# EAGLE design alfie (EAGLE 6.2)
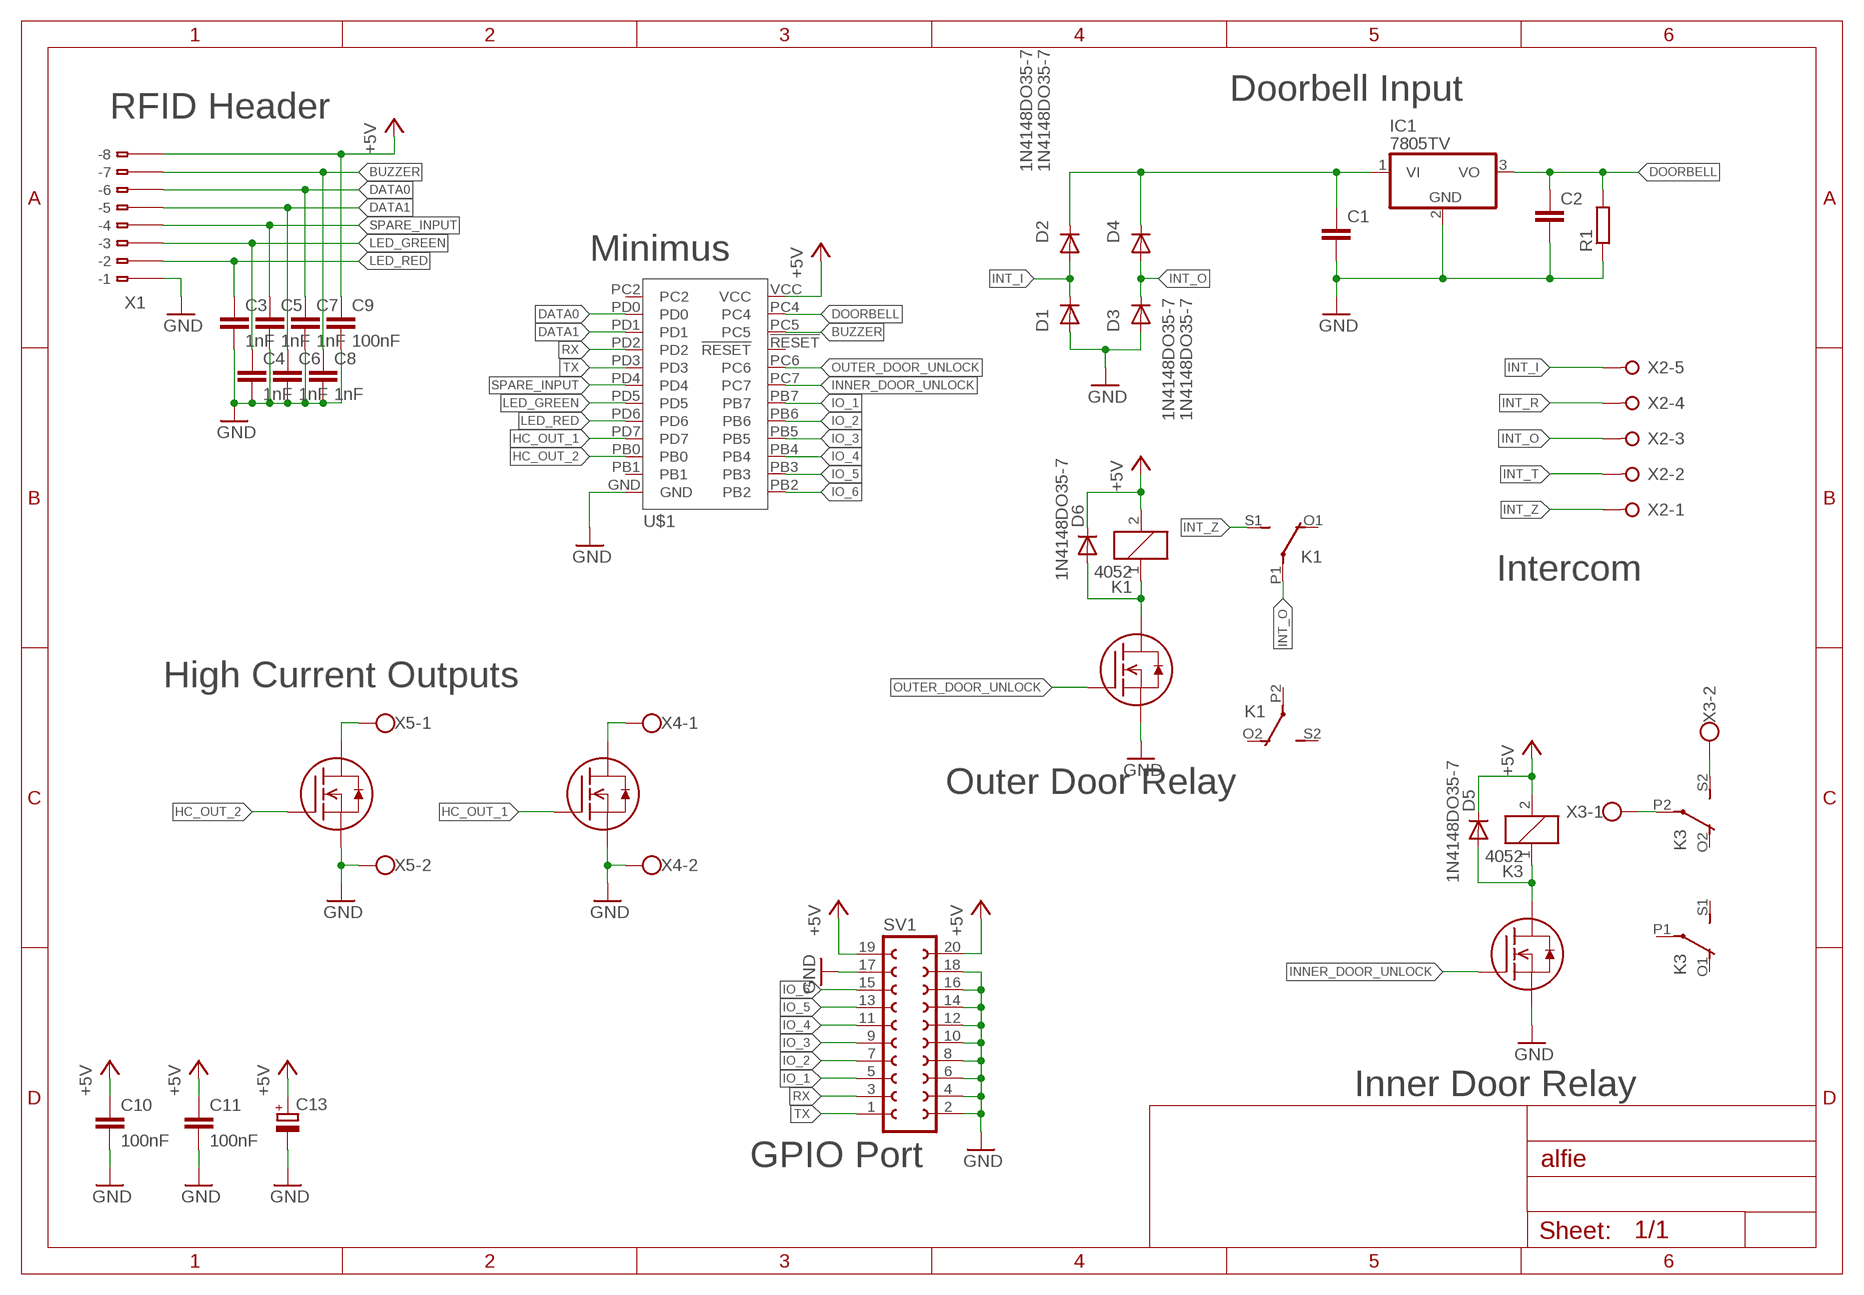
[diagram p0: schematic, sheet 1]

## Parts
C1  C-EU025-030X050  [C025-030X050]
C2  C-EU025-030X050  [C025-030X050]
C3  1nF  C-EUC0805  [C0805]
C4  1nF  C-EUC0805  [C0805]
C5  1nF  C-EUC0805  [C0805]
C6  1nF  C-EUC0805  [C0805]
C7  1nF  C-EUC0805  [C0805]
C8  1nF  C-EUC0805  [C0805]
C9  100nF  C-EUC0805  [C0805]
C10  100nF  C-EUC0805  [C0805]
C11  100nF  C-EUC0805  [C0805]
C13  CPOL-EUE5-8.5  [E5-8,5]
D1  1N4148DO35-7  [DO35-7]
D2  1N4148DO35-7  [DO35-7]
D3  1N4148DO35-7  [DO35-7]
D4  1N4148DO35-7  [DO35-7]
D5  1N4148DO35-7  [DO35-7]
D6  1N4148DO35-7  [DO35-7]
IC1  7805TV  [TO220V]
K1  4052  [F4052]
K3  4052  [F4052]
R1  R-EU_0207/10  [0207/10]
SV1  FE10-2  [FE10-2]
U$1  MINIMUS  [MINIMUS]
U$2  NTF3055L108T1GTAB  [SOT223]
U$3  NTF3055L108T1GTAB  [SOT223]
U$4  NTF3055L108T1GTAB  [SOT223]
U$5  NTF3055L108T1GTAB  [SOT223]
X1  233-508  [233-508]
X2  W237-05P  [W237-5P]
X3  W237-102  [W237-102]
X4  W237-102  [W237-102]
X5  W237-102  [W237-102]

## Nets
+5V: C9.1 C10.1 C11.1 C13.+ D5.C D6.C K1.2 K3.2 SV1.19 SV1.20 U$1.VCC X1.B8(B-8)
BUZZER: C8.1 U$1.PC5 X1.B7(B-7)
DATA0: C7.1 U$1.PD0 X1.B6(B-6)
DATA1: C6.1 U$1.PD1 X1.B5(B-5)
DOORBELL: C2.1 IC1.3(VO) R1.2 U$1.PC4
GND: C1.2 C2.2 C3.2 C4.2 C5.2 C6.2 C7.2 C8.2 C9.2 C10.2 C11.2 C13.- D1.A D3.A IC1.2(GND) R1.1 SV1.2 SV1.4 SV1.6 SV1.8 SV1.10 SV1.12 SV1.14 SV1.16 SV1.17 SV1.18 U$1.GND U$2.3(S) U$3.3(S) U$4.3(S) U$5.3(S) X1.B1(B-1) X4.2 X5.2
HC_OUT_1: U$1.PD7 U$3.1(G)
HC_OUT_2: U$1.PB0 U$4.1(G)
INNER_DOOR_UNLOCK: U$1.PC7 U$5.1(G)
INT_I: D1.C D2.A X2.5
INT_O: D3.C D4.A K1.P1(2:P) X2.3
INT_R: X2.4
INT_T: X2.2
INT_Z: K1.S1(2:S) X2.1
IO_1: SV1.5 U$1.PB7
IO_2: SV1.7 U$1.PB6
IO_3: SV1.9 U$1.PB5
IO_4: SV1.11 U$1.PB4
IO_5: SV1.13 U$1.PB3
IO_6: SV1.15 U$1.PB2
LED_GREEN: C4.1 U$1.PD5 X1.B3(B-3)
LED_RED: C3.1 U$1.PD6 X1.B2(B-2)
N$1: D6.A K1.1 U$2.4(D)
N$2: D5.A K3.1 U$5.4(D)
N$3: C1.1 D2.C D4.C IC1.1(VI)
N$4: K3.P2(3:P) X3.1
N$5: U$3.4(D) X4.1
N$6: K3.S2(3:S) X3.2
N$8: U$4.4(D) X5.1
OUTER_DOOR_UNLOCK: U$1.PC6 U$2.1(G)
RX: SV1.3 U$1.PD2
SPARE_INPUT: C5.1 U$1.PD4 X1.B4(B-4)
TX: SV1.1 U$1.PD3
Unconnected: K1.O1(2:O) K1.O2(3:O) K1.P2(3:P) K1.S2(3:S) K3.O1(2:O) K3.O2(3:O) K3.P1(2:P) K3.S1(2:S) U$1.!RESET U$1.PB1 U$1.PC2 X1.A1(-1) X1.A2(-2) X1.A3(-3) X1.A4(-4) X1.A5(-5) X1.A6(-6) X1.A7(-7) X1.A8(-8)

## Notes on the sheet
- Doorbell Input
- RFID Header
- Minimus
- Intercom
- High Current Outputs
- Outer Door Relay
- Inner Door Relay
- GPIO Port

## Library data of the parts
C1-C11 = rcl:C-EU: CAPACITOR, European symbol
C13 = rcl:CPOL-EU: POLARIZED CAPACITOR, European symbol
D1-D6 = diode:1N4148: DIODE high speed (Philips)
IC1 = linear:78*: Positive VOLTAGE REGULATOR Source: http://cache.national.com/ds/LM/LM78L05.pdf http://www.fairchildsemi.com/ds/LM/LM7805.pdf
K1 K3 = relay:4052: RELAY 2 x switch, Finder; OC_FARNELL: unknown; OC_NEWARK: unknown
R1 = rcl:R-EU_: RESISTOR, European symbol
SV1 = con-lsta:FE10-2: FEMALE HEADER; OC_FARNELL: unknown; OC_NEWARK: unknown
U$1 = minimus:MINIMUS
U$2-U$5 = NTF3055L108:NTF3055L108T1G: Power MOSFET 3.0 A, 60 V, Logic Level, N?Channel SOT?223 Designed for low voltage, high speed switching applications in power supplies, converters and power motor controls and bridge circuits
X1 = con-wago:233-508: WAGO Cage Clamp; MF: Wago Corporation; MPN: 0233-0508; OC_FARNELL: 1777101; OC_NEWARK: 79K2053
X2 = con-wago-508:W237-05P: WAGO SREW CLAMP; OC_FARNELL: unknown; OC_NEWARK: unknown
X3-X5 = con-wago-500:W237-102: WAGO SCREW CLAMP; MPN: 237-102; OC_FARNELL: unknown; OC_NEWARK: 70K9898

## Board
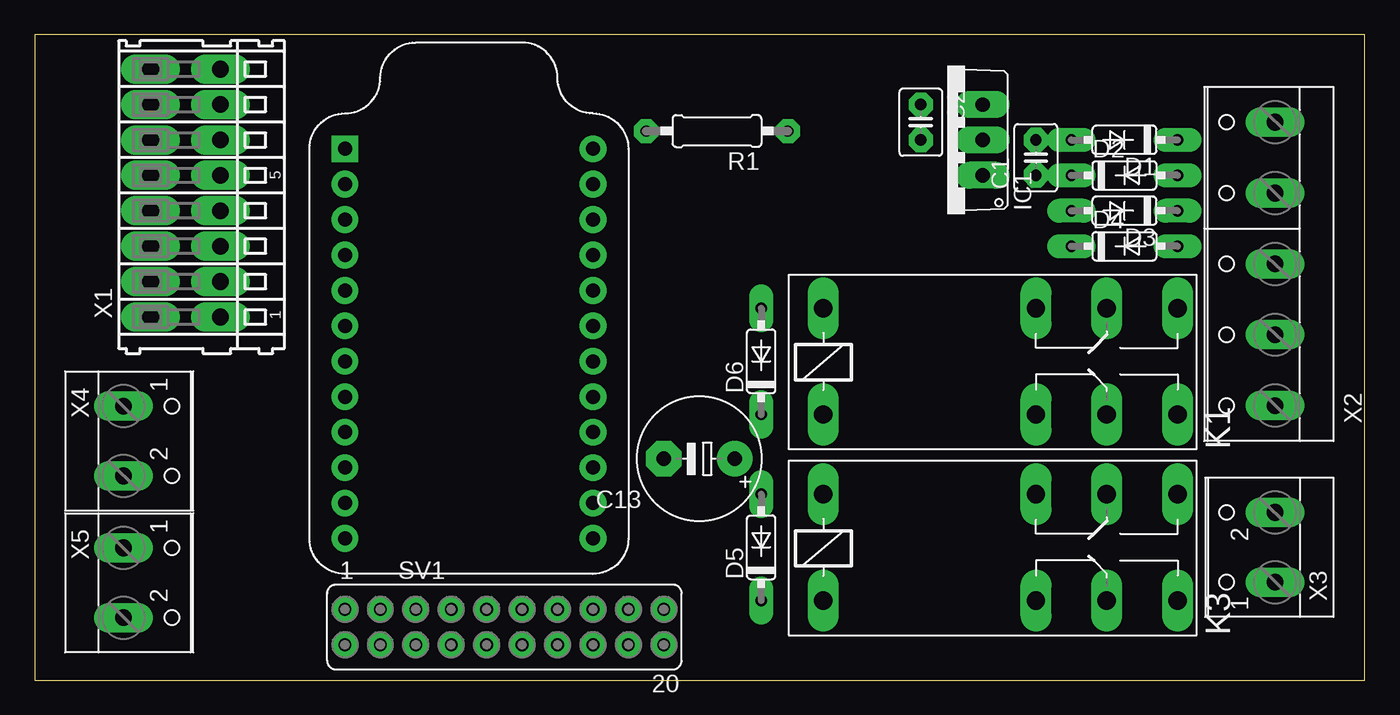
[diagram p1: board, top side]
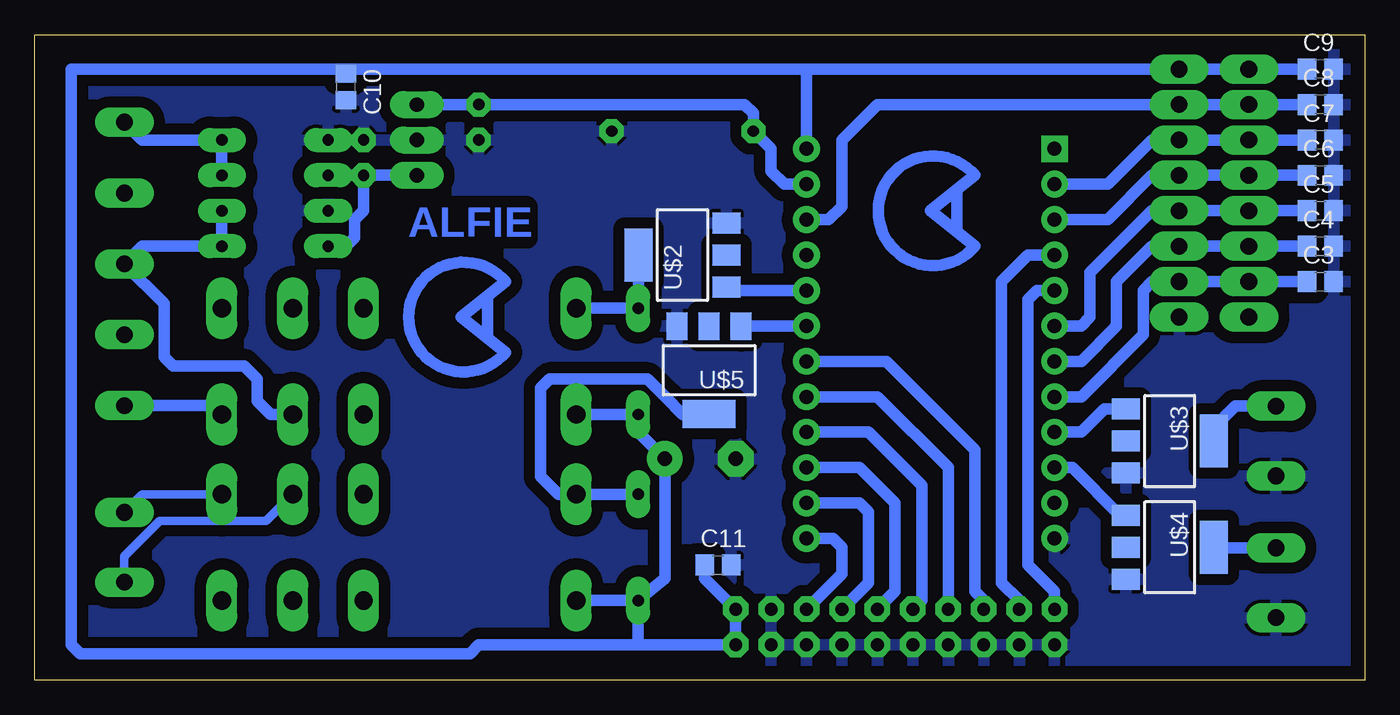
[diagram p2: board, bottom side, seen from below]

Size 95.32 x 46.27 mm. Coordinates in mm from the lower left corner, seen from the top.
Outline: 0,0 95.32,0 95.32,46.27 0,46.27 0,0
Copper layers (1*16): Top 0.035mm / dielectric 1.5mm / Bottom 0.035mm
Design rules: minimum track width 10mil, minimum drill 0.8mm, track to track 8mil, track to pad 8mil, pad to pad 8mil, via to via 8mil, smd to smd 8mil, copper to edge 40mil, drill to drill 8mil, minimum pad ring 18mil, minimum via ring 8mil, stop-mask expansion 4mil, vias tented up to drill 0mil, thermal gap 10mil

### Footprints (pad centres in the part's own frame; a part is rotated, then mirrored left to right if it is on the bottom)
C025-030X050 = drill 0.813 octagon: 1 -1.27,0; 2 1.27,0
C0805 = smd 1.3 x 1.5: 1 -0.95,0; 2 0.95,0
E5-8,5 = drill 1.016 pad 2.54: + -2.54,0 | drill 1.016 pad 2.54 octagon: - 2.54,0
DO35-7 = drill 0.813 long: A 3.81,0; C -3.81,0
TO220V = drill 1.016 long: 1 -2.54,-2.54; 2 0,-2.54; 3 2.54,-2.54
F4052 = drill 1.321 long: 1 -3.81,3.81; 2 -3.81,-3.81; O1 11.43,-3.81; O2 11.43,3.81; P1 16.51,-3.81; P2 16.51,3.81; S1 21.59,-3.81; S2 21.59,3.81
0207/10 = drill 0.813 octagon: 1 -5.08,0; 2 5.08,0
FE10-2 = drill 0.914 octagon: 1 -11.43,1.27; 2 -11.43,-1.27; 3 -8.89,1.27; 4 -8.89,-1.27; 5 -6.35,1.27; 6 -6.35,-1.27; 7 -3.81,1.27; 8 -3.81,-1.27; 9 -1.27,1.27; 10 -1.27,-1.27; 11 1.27,1.27; 12 1.27,-1.27; 13 3.81,1.27; 14 3.81,-1.27; 15 6.35,1.27; 16 6.35,-1.27; 17 8.89,1.27; 18 8.89,-1.27; 19 11.43,1.27; 20 11.43,-1.27
MINIMUS = drill 1: !RESET 17.78,-7.62; GND 0,-27.94; PB0 0,-22.86; PB1 0,-25.4; PB2 17.78,-27.94; PB3 17.78,-25.4; PB4 17.78,-22.86; PB5 17.78,-20.32; PB6 17.78,-17.78; PB7 17.78,-15.24; PC4 17.78,-2.54; PC5 17.78,-5.08; PC6 17.78,-10.16; PC7 17.78,-12.7; PD0 0,-2.54; PD1 0,-5.08; PD2 0,-7.62; PD3 0,-10.16; PD4 0,-12.7; PD5 0,-15.24; PD6 0,-17.78; PD7 0,-20.32; VCC 17.78,0 | drill 1 square: PC2 0,0
SOT223 = smd 1.5 x 2: 1 -2.3,-3.15; 2 0,-3.15; 3 2.3,-3.15 | smd 3.8 x 2: 4 0,3.15
233-508 = drill 1.2 long: A1 -8.89,2.5; A2 -6.35,2.5; A3 -3.81,2.5; A4 -1.27,2.5; A5 1.27,2.5; A6 3.81,2.5; A7 6.35,2.5; A8 8.89,2.5; B1 -8.89,-2.5; B2 -6.35,-2.5; B3 -3.81,-2.5; B4 -1.27,-2.5; B5 1.27,-2.5; B6 3.81,-2.5; B7 6.35,-2.5; B8 8.89,-2.5
W237-5P = drill 1.194 long: 1 -10.16,-0.635; 2 -5.08,-0.635; 3 0,-0.635; 4 5.08,-0.635; 5 10.16,-0.635
W237-102 = drill 1.194 long: 1 -2.5,-1.27; 2 2.5,-1.27

### Placement (x,y rotation side)
C1  71.76,37.46 90 top
C2  63.5,40 270 top
C3  3.17,28.58 0 bottom
C4  3.17,31.12 0 bottom
C5  3.17,33.66 0 bottom
C6  3.17,36.2 0 bottom
C7  3.17,38.73 0 bottom
C8  3.17,41.27 0 bottom
C9  3.17,43.81 0 bottom
C10  73.03,42.54 270 bottom
C11  46.35,8.26 0 bottom
C13  47.62,15.88 180 top
D1  78.11,38.73 180 top
D2  78.11,36.2 0 top
D3  78.11,33.66 180 top
D4  78.11,31.12 0 top
D5  52.07,9.53 90 top
D6  52.07,22.86 90 top
IC1  65.41,38.73 90 top
K1  60.32,22.86 0 top
K3  60.32,9.53 0 top
R1  48.89,39.37 180 top
SV1  33.66,3.81 0 top
U$1  22.23,38.1 0 top
U$2  48.89,30.48 90 bottom
U$3  13.97,17.15 270 bottom
U$4  13.97,9.53 270 bottom
U$5  46.99,22.23 180 bottom
X1  10.79,34.92 90 top
X2  88.27,29.85 90 top
X3  87.63,9.53 90 top
X4  7.62,17.15 270 top
X5  7.62,6.98 270 top

### Tracks (layer width: path | path; a pad name or v marks a point on that pad's centre or on a via)
+5V
  Bottom 0.813: 40,43.81 73.03,43.81 | 73.03,43.81 92.71,43.81 92.71,2.54 92.08,1.91 64.14,1.91 63.5,2.54 52.07,2.54 | U$1.VCC 40,43.81 | 40,43.81 X1.B8 C9.1 | C10.1 73.03,43.81 | 52.07,2.54 SV1.20 SV1.19 47.31,7.3 C11.1 | D5.C K3.2 | D5.C 52.07,2.54 | D5.C 50.16,7.3 C13.+ 52.07,17.78 D6.C K1.2
BUZZER
  Bottom 0.813: U$1.PC5 38.42,33.02 37.46,33.97 37.46,38.73 34.92,41.27 X1.B7 C8.1
DATA0
  Bottom 0.813: C7.1 X1.B6 15.24,38.73 18.42,35.56 U$1.PD0
DATA1
  Bottom 0.813: C6.1 X1.B5 15.24,36.2 18.42,33.02 U$1.PD1
DOORBELL
  Bottom 0.813: IC1.3 C2.1 44.45,41.27 43.81,40.64 R1.2 42.54,38.1 42.54,36.51 41.59,35.56 U$1.PC4
GND
  pour Bottom (isolate 0.813): -4.37,50.63 98.42,50.63 98.42,-4.37 -4.37,-4.37
HC_OUT_1
  Bottom 0.813: U$1.PD7 20.32,17.78 18.66,19.45 U$3.1
HC_OUT_2
  Bottom 0.813: U$1.PB0 20.96,15.24 17.54,11.82 U$4.1
INNER_DOOR_UNLOCK
  Bottom 0.813: U$1.PC7 44.69,25.4 U$5.1 44.69,24.77
INT_I
  Bottom 0.813: X2.5 87.63,38.73 D1.C D2.A
INT_O
  Bottom 0.813: D3.C D4.A 87.63,31.12 X2.3 86.04,26.99 86.04,23.18 85.41,22.54 80.33,22.54 79.38,21.59 79.38,20 78.42,19.05 K1.P1
INT_Z
  Bottom 0.813: X2.1 82.55,19.69 K1.S1
IO_1
  Bottom 0.813: SV1.5 27.31,5.71 27.94,6.35 27.94,16.51 34.29,22.86 U$1.PB7
IO_2
  Bottom 0.813: SV1.7 29.85,15.24 34.92,20.32 U$1.PB6
IO_3
  Bottom 0.813: SV1.9 31.75,5.71 31.75,13.97 35.56,17.78 U$1.PB5
IO_4
  Bottom 0.813: SV1.11 33.66,6.35 33.66,12.7 36.2,15.24 U$1.PB4
IO_5
  Bottom 0.813: SV1.13 35.56,6.98 35.56,12.06 36.2,12.7 U$1.PB3
IO_6
  Bottom 0.813: SV1.15 37.46,7.62 37.46,9.53 38.1,10.16 U$1.PB2
LED_GREEN
  Bottom 0.813: C4.1 X1.B3 15.24,31.12 17.78,28.58 17.78,25.4 20.32,22.86 U$1.PD5
LED_RED
  Bottom 0.813: C3.1 X1.B2 15.24,28.58 15.88,27.94 15.88,24.77 20.32,20.32 U$1.PD6
N$1
  Bottom 0.813: K1.1 D6.A 52.04,26.01 U$2.4
N$2
  Bottom 0.813: U$5.4 48.89,19.05 50.16,20.35 51.41,21.59 58.42,21.59 59.05,20.96 59.05,14.61 57.78,13.33 K3.1 D5.A
N$3
  Bottom 0.813: D2.C C1.1 | C1.1 71.76,33.66 72.39,33.02 72.39,31.75 73.03,31.12 D4.C | C1.1 IC1.1
N$4
  Bottom 0.61: X3.1 88.9,8.89 86.36,11.43 78.74,11.43 K3.P2
N$5
  Bottom 0.813: U$3.4 10.16,18.73 10.16,18.76 9.27,19.65 X4.1
N$6
  Bottom 0.61: K3.S2 87.63,13.33 88.9,12.06 X3.2
N$7
  Bottom 0.813: 27.94,31.12 arc279 27.94,36.2 31.12,33.66 27.94,31.12
N$8
  Bottom 0.813: U$4.4 10.78,9.48 X5.1
N$9
  Bottom 0.813: 29.21,34.92 29.21,32.38
N$10
  Bottom 0.813: 61.59,23.5 arc279 61.59,28.58 64.77,26.04 61.59,23.5
N$11
  Bottom 0.813: 62.86,27.31 62.86,24.77
OUTER_DOOR_UNLOCK
  Bottom 0.813: U$1.PC6 45.5,27.94 U$2.1
RX
  Bottom 0.813: U$1.PD2 24.13,30.48 26.04,28.58 26.04,6.98 24.77,5.71 SV1.3
SPARE_INPUT
  Bottom 0.813: C5.1 X1.B4 15.24,33.66 19.69,29.21 19.69,26.04 20.32,25.4 U$1.PD4
TX
  Bottom 0.813: U$1.PD3 23.5,27.94 24.13,27.31 24.13,8.26 22.23,6.35 SV1.1

### Text on the board
Bottom: ALFIE